# Altium schematic sheet OECU_BASE5.SchDoc
size A4; SheetNumber: 5; SheetTotal: 6
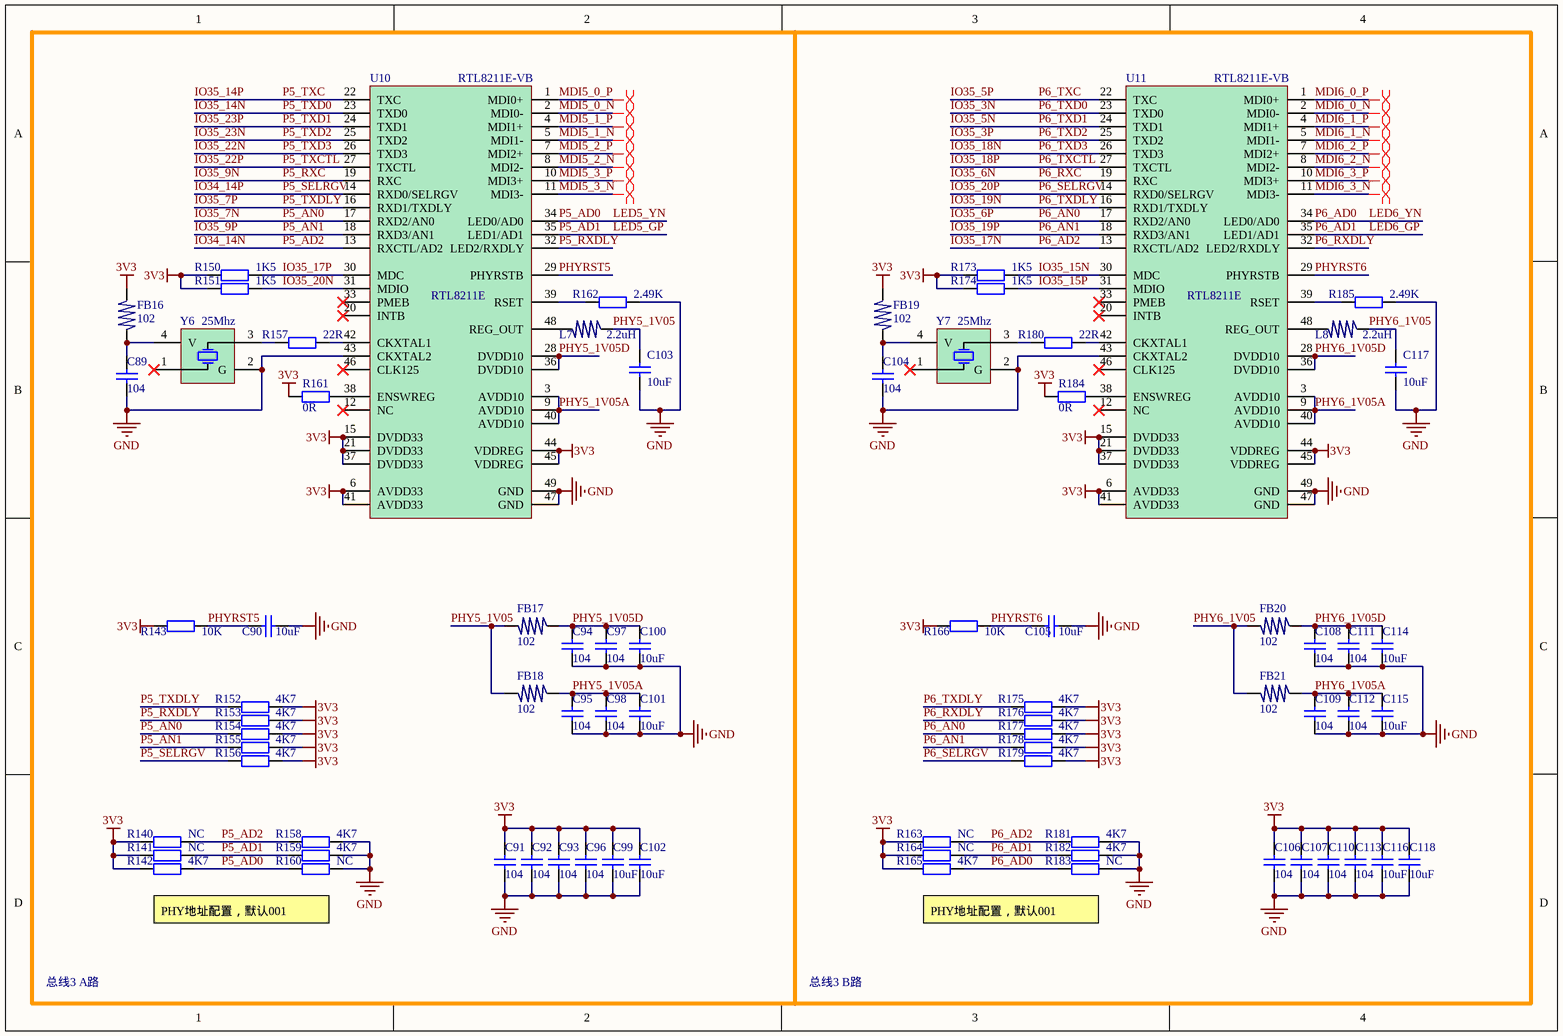
[diagram p0: OECU_BASE5.SchDoc]

## Parts
C89  104  [0402]
C90  10uF  [0402]
C91  104  [0402]
C92  104  [0402]
C93  104  [0402]
C94  104  [0402]
C95  104  [0402]
C96  104  [0402]
C97  104  [0402]
C98  104  [0402]
C99  10uF  [0402]
C100  10uF  [0402]
C101  10uF  [0402]
C102  10uF  [0402]
C103  10uF  [0402]
C104  104  [0402]
C105  10uF  [0402]
C106  104  [0402]
C107  104  [0402]
C108  104  [0402]
C109  104  [0402]
C110  104  [0402]
C111  104  [0402]
C112  104  [0402]
C113  104  [0402]
C114  10uF  [0402]
C115  10uF  [0402]
C116  10uF  [0402]
C117  10uF  [0402]
C118  10uF  [0402]
FB16  102  [0402]
FB17  102  [0603]
FB18  102  [0603]
FB19  102  [0402]
FB20  102  [0603]
FB21  102  [0603]
L7  2.2uH  [0805]
L8  2.2uH  [0805]
R140  NC  [R_0402]
R141  NC  [R_0402]
R142  4K7  [R_0402]
R143  10K  [R_0402]
R150  1K5  [R_0402]
R151  1K5  [R_0402]
R152  4K7  [R_0402]
R153  4K7  [R_0402]
R154  4K7  [R_0402]
R155  4K7  [R_0402]
R156  4K7  [R_0402]
R157  22R  [R_0402]
R158  4K7  [R_0402]
R159  4K7  [R_0402]
R160  NC  [R_0402]
R161  0R  [R_0402]
R162  2.49K  [R_0402]
R163  NC  [R_0402]
R164  NC  [R_0402]
R165  4K7  [R_0402]
R166  10K  [R_0402]
R173  1K5  [R_0402]
R174  1K5  [R_0402]
R175  4K7  [R_0402]
R176  4K7  [R_0402]
R177  4K7  [R_0402]
R178  4K7  [R_0402]
R179  4K7  [R_0402]
R180  22R  [R_0402]
R181  4K7  [R_0402]
R182  4K7  [R_0402]
R183  NC  [R_0402]
R184  0R  [R_0402]
R185  2.49K  [R_0402]
U10  RTL8211E-VB  [QFN48]
U11  RTL8211E-VB  [QFN48]
Y6  25Mhz  [XTAL_3225]
Y7  25Mhz  [XTAL_3225]

## Nets
3V3: C91.1 C92.1 C93.1 C96.1 C99.1 C102.1 C106.1 C107.1 C110.1 C113.1 C116.1 C118.1 FB16.2 FB19.2 R140.1 R141.1 R142.1 R143.1 R150.2 R151.2 R152.2 R153.2 R154.2 R155.2 R156.2 R161.2 R163.1 R164.1 R165.1 R166.1 R173.2 R174.2 R175.2 R176.2 R177.2 R178.2 R179.2 R184.2 U10.6(AVDD33) U10.15(DVDD33) U10.21(DVDD33) U10.37(DVDD33) U10.41(AVDD33) U10.44(VDDREG) U10.45(VDDREG) U11.6(AVDD33) U11.15(DVDD33) U11.21(DVDD33) U11.37(DVDD33) U11.41(AVDD33) U11.44(VDDREG) U11.45(VDDREG)
GND: C89.1 C90.2 C91.2 C92.2 C93.2 C94.1 C95.1 C96.2 C97.1 C98.1 C99.2 C100.1 C101.1 C102.2 C103.1 C104.1 C105.2 C106.2 C107.2 C108.1 C109.1 C110.2 C111.1 C112.1 C113.2 C114.1 C115.1 C116.2 C117.1 C118.2 R158.2 R159.2 R160.2 R162.2 R181.2 R182.2 R183.2 R185.2 U10.43(CKXTAL2) U10.47(GND) U10.49(GND) U11.43(CKXTAL2) U11.47(GND) U11.49(GND) Y6.2(G) Y7.2(G)
IO34_14N: R140.2 R158.1 U10.13(RXCTL/AD2)  [also labelled P5_AD2]
IO34_14P: R156.1 U10.14(RXD0/SELRGV)  [also labelled P5_SELRGV]
IO35_3N: U11.23(TXD0)  [also labelled P6_TXD0]
IO35_3P: U11.25(TXD2)  [also labelled P6_TXD2]
IO35_5N: U11.24(TXD1)  [also labelled P6_TXD1]
IO35_5P: U11.22(TXC)  [also labelled P6_TXC]
IO35_6N: U11.19(RXC)  [also labelled P6_RXC]
IO35_6P: R177.1 U11.17(RXD2/AN0)  [also labelled P6_AN0]
IO35_7N: R154.1 U10.17(RXD2/AN0)  [also labelled P5_AN0]
IO35_7P: R152.1 U10.16(RXD1/TXDLY)  [also labelled P5_TXDLY]
IO35_9N: U10.19(RXC)  [also labelled P5_RXC]
IO35_9P: R155.1 U10.18(RXD3/AN1)  [also labelled P5_AN1]
IO35_14N: U10.23(TXD0)  [also labelled P5_TXD0]
IO35_14P: U10.22(TXC)  [also labelled P5_TXC]
IO35_15N: R173.1 U11.30(MDC)
IO35_15P: R174.1 U11.31(MDIO)
IO35_17N: R163.2 R181.1 U11.13(RXCTL/AD2)  [also labelled P6_AD2]
IO35_17P: R150.1 U10.30(MDC)
IO35_18N: U11.26(TXD3)  [also labelled P6_TXD3]
IO35_18P: U11.27(TXCTL)  [also labelled P6_TXCTL]
IO35_19N: R175.1 U11.16(RXD1/TXDLY)  [also labelled P6_TXDLY]
IO35_19P: R178.1 U11.18(RXD3/AN1)  [also labelled P6_AN1]
IO35_20N: R151.1 U10.31(MDIO)
IO35_20P: R179.1 U11.14(RXD0/SELRGV)  [also labelled P6_SELRGV]
IO35_22N: U10.26(TXD3)  [also labelled P5_TXD3]
IO35_22P: U10.27(TXCTL)  [also labelled P5_TXCTL]
IO35_23N: U10.25(TXD2)  [also labelled P5_TXD2]
IO35_23P: U10.24(TXD1)  [also labelled P5_TXD1]
LED5_GP: R141.2 R159.1 U10.35(LED1/AD1)  [also labelled P5_AD1]
LED5_YN: R142.2 R160.1 U10.34(LED0/AD0)  [also labelled P5_AD0]
LED6_GP: R164.2 R182.1 U11.35(LED1/AD1)  [also labelled P6_AD1]
LED6_YN: R165.2 R183.1 U11.34(LED0/AD0)  [also labelled P6_AD0]
MDI5_0_N: U10.2(MDI0-)
MDI5_0_P: U10.1(MDI0+)
MDI5_1_N: U10.5(MDI1-)
MDI5_1_P: U10.4(MDI1+)
MDI5_2_N: U10.8(MDI2-)
MDI5_2_P: U10.7(MDI2+)
MDI5_3_N: U10.11(MDI3-)
MDI5_3_P: U10.10(MDI3+)
MDI6_0_N: U11.2(MDI0-)
MDI6_0_P: U11.1(MDI0+)
MDI6_1_N: U11.5(MDI1-)
MDI6_1_P: U11.4(MDI1+)
MDI6_2_N: U11.8(MDI2-)
MDI6_2_P: U11.7(MDI2+)
MDI6_3_N: U11.11(MDI3-)
MDI6_3_P: U11.10(MDI3+)
P5_RXDLY: R153.1 U10.32(LED2/RXDLY)
P6_RXDLY: R176.1 U11.32(LED2/RXDLY)
PHY5_1V05: C103.2 FB17.1 FB18.1 L7.1
PHY5_1V05A: C95.2 C98.2 C101.2 FB18.2 U10.3(AVDD10) U10.9(AVDD10) U10.40(AVDD10)
PHY5_1V05D: C94.2 C97.2 C100.2 FB17.2 U10.28(DVDD10) U10.36(DVDD10)
PHY6_1V05: C117.2 FB20.1 FB21.1 L8.1
PHY6_1V05A: C109.2 C112.2 C115.2 FB21.2 U11.3(AVDD10) U11.9(AVDD10) U11.40(AVDD10)
PHY6_1V05D: C108.2 C111.2 C114.2 FB20.2 U11.28(DVDD10) U11.36(DVDD10)
PHYRST5: C90.1 R143.2 U10.29(PHYRSTB)
PHYRST6: C105.1 R166.2 U11.29(PHYRSTB)
NetC89_2: C89.2 FB16.1 Y6.4(V)
NetC104_2: C104.2 FB19.1 Y7.4(V)
NetL7_2: L7.2 U10.48(REG_OUT)
NetL8_2: L8.2 U11.48(REG_OUT)
NetR157_1: R157.1 U10.42(CKXTAL1)
NetR157_2: R157.2 Y6.3(OP)
NetR161_1: R161.1 U10.38(ENSWREG)
NetR162_1: R162.1 U10.39(RSET)
NetR180_1: R180.1 U11.42(CKXTAL1)
NetR180_2: R180.2 Y7.3(OP)
NetR184_1: R184.1 U11.38(ENSWREG)
NetR185_1: R185.1 U11.39(RSET)

Not connected (* = marked no-connect by the designer): U10 12(NC)* 20(INTB)* 33(PMEB)* 46(CLK125)*; U11 12(NC)* 20(INTB)* 33(PMEB)* 46(CLK125)*; Y6 1(EC)*; Y7 1(EC)*

## Layout directives
differential pair: MDI5_0_N, MDI5_0_P, MDI5_1_N, MDI5_1_P, MDI5_2_N, MDI5_2_P, MDI5_3_N, MDI5_3_P, MDI6_0_N, MDI6_0_P, MDI6_1_N, MDI6_1_P, MDI6_2_N, MDI6_2_P, MDI6_3_N, MDI6_3_P

## Notes on the sheet
- PHY地址配置，默认001
- 总线3 A路
- 总线3 B路

## Library data of the parts
C89-C118 = CAP_0402: 贴片电容 0402
FB16 FB19 = FB_0402: 磁珠 0402
FB17 FB18 FB20 FB21 = FB_0603: 磁珠 0603
L7 L8 = L_0805: 电感 0805
R140-R143 R150-R166 R173-R185 = RES_0402: 电阻 0402
U10 U11 = RTL8211E: QFN48
Y6 Y7 = XTAL_3225